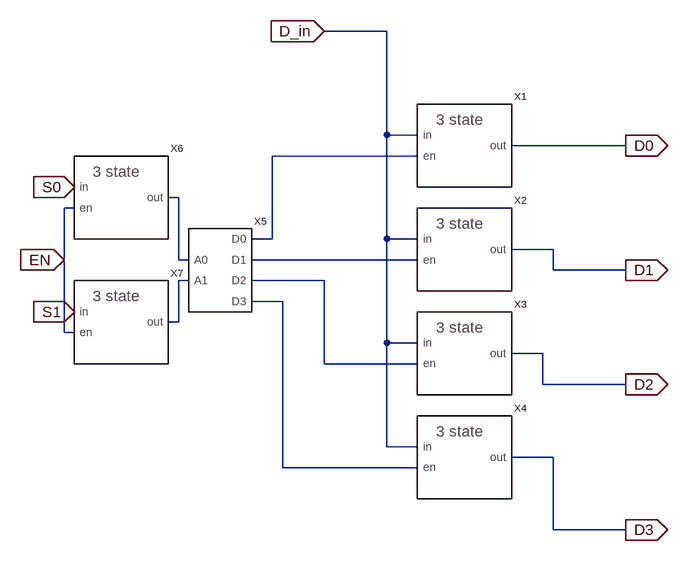
[diagram p0: schematic demux.asc]
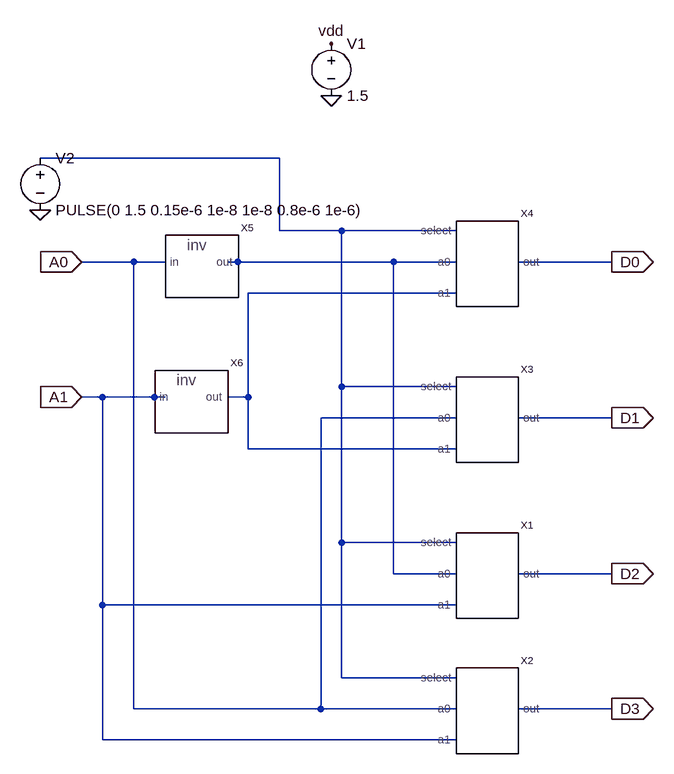
[diagram p1: sub-circuit addres_decoder.asc]
demux.asc, the LTspice schematic file:
Version 4
SHEET 1 1916 1476
WIRE 1264 -272 1168 -272
WIRE 1264 -112 1264 -272
WIRE 1312 -112 1264 -112
WIRE 1632 -96 1456 -96
WIRE 1312 -80 1088 -80
WIRE 944 -16 928 -16
WIRE 784 0 768 0
WIRE 1088 48 1088 -80
WIRE 1088 48 1056 48
WIRE 1264 48 1264 -112
WIRE 1312 48 1264 48
WIRE 1520 64 1456 64
WIRE 768 80 768 0
WIRE 944 80 944 -16
WIRE 960 80 944 80
WIRE 1312 80 1056 80
WIRE 1520 96 1520 64
WIRE 1632 96 1520 96
WIRE 960 112 944 112
WIRE 1168 112 1056 112
WIRE 1104 144 1056 144
WIRE 944 176 944 112
WIRE 944 176 928 176
WIRE 768 192 768 80
WIRE 784 192 768 192
WIRE 1264 208 1264 48
WIRE 1312 208 1264 208
WIRE 1504 224 1456 224
WIRE 1168 240 1168 112
WIRE 1312 240 1168 240
WIRE 1504 272 1504 224
WIRE 1632 272 1504 272
WIRE 1264 368 1264 208
WIRE 1312 368 1264 368
WIRE 1520 384 1456 384
WIRE 1104 400 1104 144
WIRE 1312 400 1104 400
WIRE 1520 496 1520 384
WIRE 1632 496 1520 496
FLAG 784 -32 S0
IOPIN 784 -32 In
FLAG 784 160 S1
IOPIN 784 160 In
FLAG 1632 -96 D0
IOPIN 1632 -96 Out
FLAG 1632 272 D2
IOPIN 1632 272 Out
FLAG 1632 96 D1
IOPIN 1632 96 Out
FLAG 1632 496 D3
IOPIN 1632 496 Out
FLAG 1168 -272 D_in
IOPIN 1168 -272 In
FLAG 768 80 EN
IOPIN 768 80 In
SYMBOL three_state_new 1392 -128 R0
SYMATTR InstName X1
SYMBOL three_state_new 1392 32 R0
SYMATTR InstName X2
SYMBOL three_state_new 1392 192 R0
SYMATTR InstName X3
SYMBOL three_state_new 1392 352 R0
SYMATTR InstName X4
SYMBOL addres_decoder 1008 96 R0
SYMATTR InstName X5
SYMBOL three_state_new 864 -48 R0
SYMATTR InstName X6
SYMBOL three_state_new 864 144 R0
SYMATTR InstName X7

addres_decoder.asc, the sub-circuit schematic file:
Version 4
SHEET 1 880 680
WIRE -128 -368 -496 -368
WIRE -128 -256 -128 -368
WIRE -32 -256 -128 -256
WIRE 144 -256 -32 -256
WIRE -352 -208 -432 -208
WIRE -304 -208 -352 -208
WIRE -192 -208 -208 -208
WIRE 48 -208 -192 -208
WIRE 144 -208 48 -208
WIRE 384 -208 240 -208
WIRE 144 -160 -176 -160
WIRE -32 -16 -32 -256
WIRE 144 -16 -32 -16
WIRE -400 0 -432 0
WIRE -320 0 -400 0
WIRE -304 0 -320 0
WIRE -176 0 -176 -160
WIRE -176 0 -208 0
WIRE 144 32 -64 32
WIRE 384 32 240 32
WIRE -176 80 -176 0
WIRE 144 80 -176 80
WIRE -32 224 -32 -16
WIRE 144 224 -32 224
WIRE 48 272 48 -208
WIRE 144 272 48 272
WIRE 384 272 240 272
WIRE -400 320 -400 0
WIRE 144 320 -400 320
WIRE -32 432 -32 224
WIRE 144 432 -32 432
WIRE -352 480 -352 -208
WIRE -64 480 -64 32
WIRE -64 480 -352 480
WIRE 144 480 -64 480
WIRE 384 480 240 480
WIRE -400 528 -400 320
WIRE 144 528 -400 528
FLAG -48 -464 0
FLAG -48 -544 vdd
FLAG -432 -208 A0
IOPIN -432 -208 In
FLAG -432 0 A1
IOPIN -432 0 In
FLAG 384 -208 D0
IOPIN 384 -208 Out
FLAG 384 32 D1
IOPIN 384 32 Out
FLAG 384 272 D2
IOPIN 384 272 Out
FLAG 384 480 D3
IOPIN 384 480 Out
FLAG -496 -288 0
SYMBOL charge_decoder 208 272 R0
SYMATTR InstName X1
SYMBOL charge_decoder 208 480 R0
SYMATTR InstName X2
SYMBOL charge_decoder 208 32 R0
SYMATTR InstName X3
SYMBOL charge_decoder 208 -208 R0
SYMATTR InstName X4
SYMBOL voltage -48 -560 R0
WINDOW 123 0 0 Left 0
WINDOW 39 0 0 Left 0
SYMATTR InstName V1
SYMATTR Value 1.5
SYMBOL invert -256 -192 R0
SYMATTR InstName X5
SYMBOL invert -272 16 R0
SYMATTR InstName X6
SYMBOL voltage -496 -384 R0
WINDOW 123 0 0 Left 0
WINDOW 39 0 0 Left 0
SYMATTR InstName V2
SYMATTR Value PULSE(0 1.5 0.15e-6 1e-8 1e-8 0.8e-6 1e-6)

The netlist it stands for:
* demux.asc
XX1 D_in N001 D0 three_state_new  ; pins in en out
XX2 D_in N003 D1 three_state_new  ; pins in en out
XX3 D_in N005 D2 three_state_new  ; pins in en out
XX4 D_in N006 D3 three_state_new  ; pins in en out
XX5 N002 N004 N001 N003 N005 N006 addres_decoder
XX6 S0 EN N002 three_state_new  ; pins in en out
XX7 S1 EN N004 three_state_new  ; pins in en out

* block symbol definitions
.subckt addres_decoder A0 A1 D0 D1 D2 D3
XX1 N001 N002 A1 D2 charge_decoder  ; pins select a0 a1 out
XX2 N001 A0 A1 D3 charge_decoder  ; pins select a0 a1 out
XX3 N001 A0 N003 D1 charge_decoder  ; pins select a0 a1 out
XX4 N001 N002 N003 D0 charge_decoder  ; pins select a0 a1 out
V1 vdd 0 1.5
XX5 A0 N002 invert  ; pins in out
XX6 A1 N003 invert  ; pins in out
V2 N001 0 PULSE(0 1.5 0.15e-6 1e-8 1e-8 0.8e-6 1e-6)
.ends addres_decoder

.backanno
.end